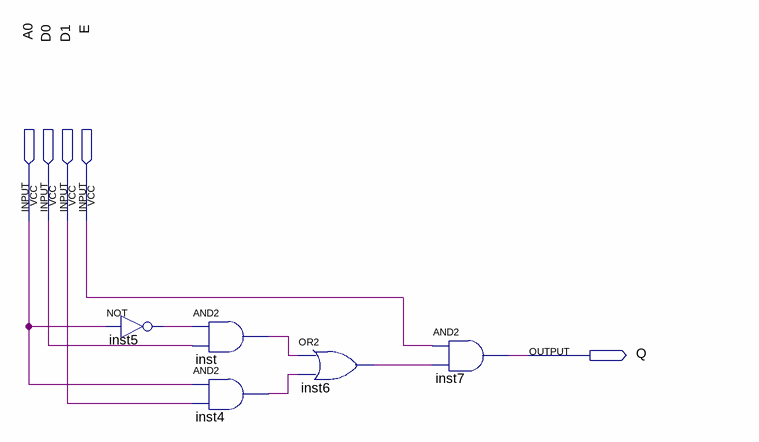
[diagram p0: schematic sheet]
// Quartus schematic MUX2x1.bdf as structural Verilog: 5 symbols, 5 pins
module MUX2x1 (
  input  A0,
  input  D0,
  input  D1,
  input  E,
  output Q
);

  wire inst4_out, inst5_out, inst6_out, inst_out;

  not inst5 (inst5_out, A0);
  and inst (inst_out, inst5_out, D0);
  and inst4 (inst4_out, A0, D1);
  or inst6 (inst6_out, inst_out, inst4_out);
  and inst7 (Q, E, inst6_out);
endmodule
